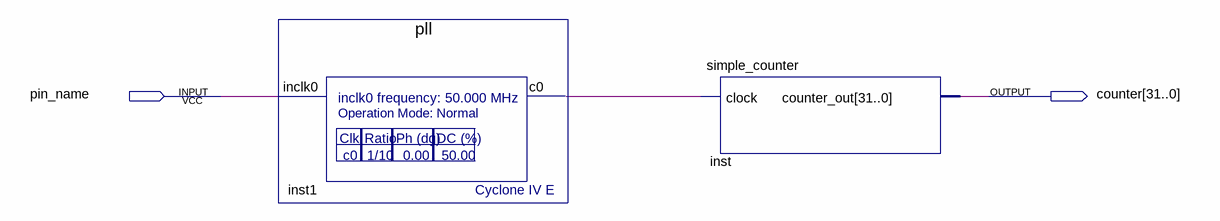
[diagram p0: schematic sheet]
// Quartus schematic t1.bdf as structural Verilog: 2 symbols, 2 pins
module t1 (
  input  pin_name,
  output [31:0] counter
);

  wire inst1_c0;

  pll inst1 (.inclk0(pin_name), .c0(inst1_c0));
  simple_counter inst (.clock(inst1_c0), .counter_out(counter));
endmodule
